# EAGLE design Adafruit NeoPixel Ring 60 Quarter rev B (EAGLE 9.6.2)
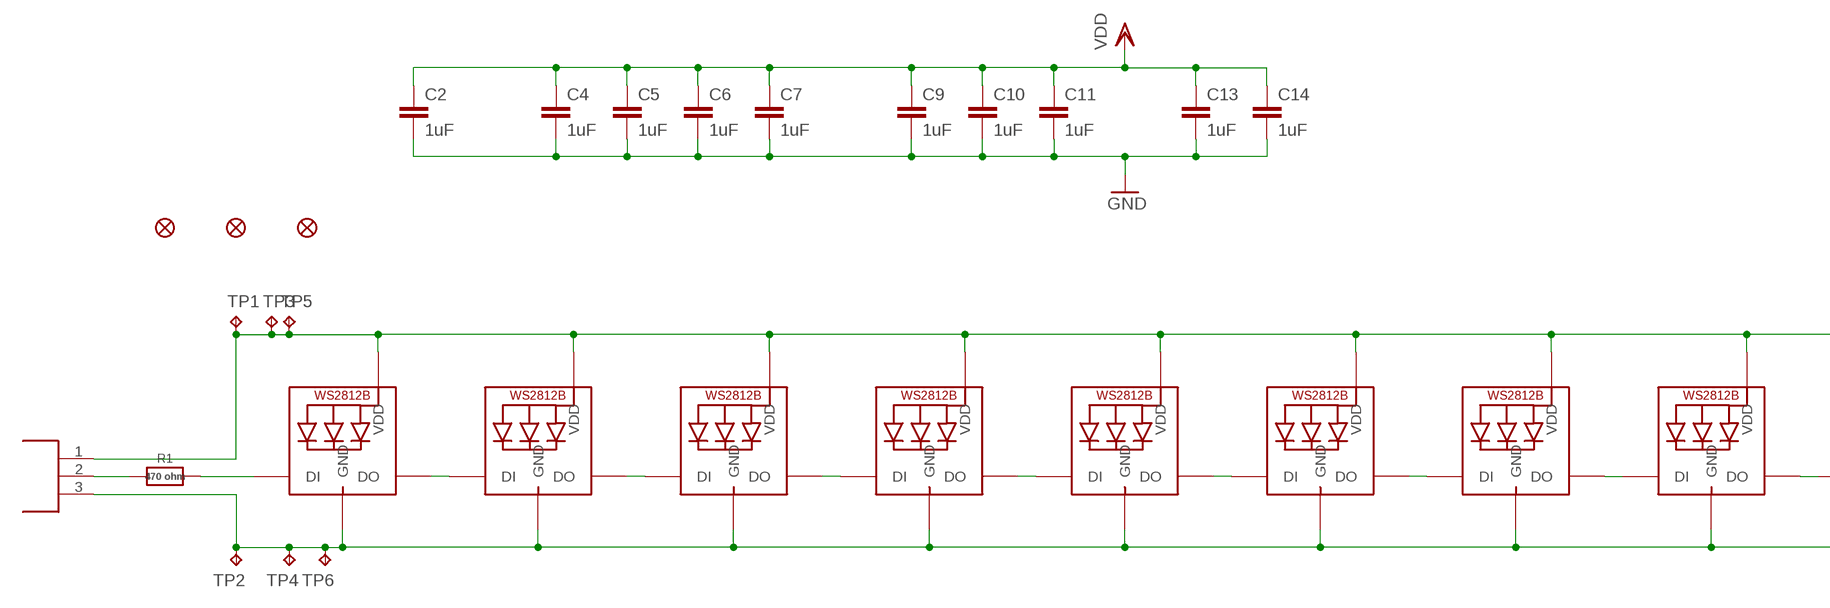
[diagram p0: schematic, sheet 1, part 1 of 2]
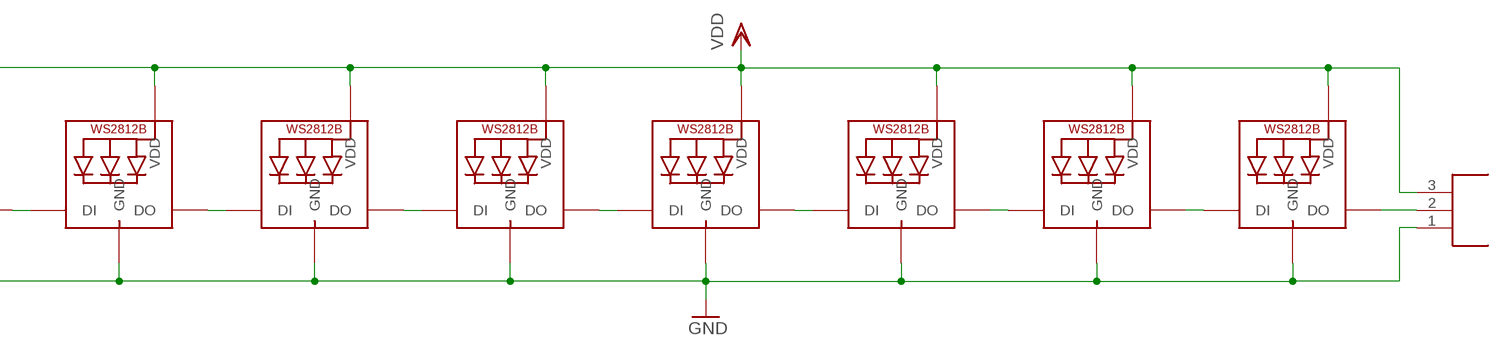
[diagram p1: schematic, sheet 1, part 2 of 2]

## Parts
C2  1uF  C-EUC0603  [C0603]
C4  1uF  C-EUC0603  [C0603]
C5  1uF  C-EUC0603  [C0603]
C6  1uF  C-EUC0603  [C0603]
C7  1uF  C-EUC0603  [C0603]
C9  1uF  C-EUC0603  [C0603]
C10  1uF  C-EUC0603  [C0603]
C11  1uF  C-EUC0603  [C0603]
C13  1uF  C-EUC0603  [C0603]
C14  1uF  C-EUC0603  [C0603]
FID1  FIDUCIAL_1MM  [FIDUCIAL_1MM]
FID2  FIDUCIAL_1MM  [FIDUCIAL_1MM]
FID3  FIDUCIAL_1MM  [FIDUCIAL_1MM]
LED1  WS2812B_5050N  [WS2812B-NARROW]
LED2  WS2812B_5050N  [WS2812B-NARROW]
LED3  WS2812B_5050N  [WS2812B-NARROW]
LED4  WS2812B_5050N  [WS2812B-NARROW]
LED5  WS2812B_5050N  [WS2812B-NARROW]
LED6  WS2812B_5050N  [WS2812B-NARROW]
LED7  WS2812B_5050N  [WS2812B-NARROW]
LED8  WS2812B_5050N  [WS2812B-NARROW]
LED9  WS2812B_5050N  [WS2812B-NARROW]
LED10  WS2812B_5050N  [WS2812B-NARROW]
LED11  WS2812B_5050N  [WS2812B-NARROW]
LED12  WS2812B_5050N  [WS2812B-NARROW]
LED13  WS2812B_5050N  [WS2812B-NARROW]
LED14  WS2812B_5050N  [WS2812B-NARROW]
LED15  WS2812B_5050N  [WS2812B-NARROW]
R1  470 ohm  RESISTOR_0603_NOOUT  [0603-NO]
TP1  TPTP20R  [TP20R]
TP2  TPTP20R  [TP20R]
TP3  TPTP20R  [TP20R]
TP4  TPTP20R  [TP20R]
TP5  TPTP20R  [TP20R]
TP6  TPTP20R  [TP20R]
U$1  DNP  RING_END_CONN_X3  [RING_END_CONN_X3]
U$2  DNP  RING_END_CONN_X3  [RING_END_CONN_X3]

## Nets
GND: C2.2 C4.2 C5.2 C6.2 C7.2 C9.2 C10.2 C11.2 C13.2 C14.2 LED1.3-GND(GND) LED2.3-GND(GND) LED3.3-GND(GND) LED4.3-GND(GND) LED5.3-GND(GND) LED6.3-GND(GND) LED7.3-GND(GND) LED8.3-GND(GND) LED9.3-GND(GND) LED10.3-GND(GND) LED11.3-GND(GND) LED12.3-GND(GND) LED13.3-GND(GND) LED14.3-GND(GND) LED15.3-GND(GND) TP2.TP TP4.TP TP6.TP U$1.3 U$2.1
N$1: LED1.2-DOUT(DO) LED2.4-DIN(DI)
N$2: LED2.2-DOUT(DO) LED3.4-DIN(DI)
N$3: LED3.2-DOUT(DO) LED4.4-DIN(DI)
N$4: LED4.2-DOUT(DO) LED5.4-DIN(DI)
N$5: LED5.2-DOUT(DO) LED6.4-DIN(DI)
N$6: LED6.2-DOUT(DO) LED7.4-DIN(DI)
N$7: LED7.2-DOUT(DO) LED8.4-DIN(DI)
N$8: LED8.2-DOUT(DO) LED9.4-DIN(DI)
N$9: LED9.2-DOUT(DO) LED10.4-DIN(DI)
N$10: LED10.2-DOUT(DO) LED11.4-DIN(DI)
N$11: LED11.2-DOUT(DO) LED12.4-DIN(DI)
N$12: LED12.2-DOUT(DO) LED13.4-DIN(DI)
N$13: LED13.2-DOUT(DO) LED14.4-DIN(DI)
N$14: LED14.2-DOUT(DO) LED15.4-DIN(DI)
N$15: LED1.4-DIN(DI) R1.2
N$16: LED15.2-DOUT(DO) U$2.2
N$17: R1.1 U$1.2
VDD: C2.1 C4.1 C5.1 C6.1 C7.1 C9.1 C10.1 C11.1 C13.1 C14.1 LED1.1-VDD(VDD) LED2.1-VDD(VDD) LED3.1-VDD(VDD) LED4.1-VDD(VDD) LED5.1-VDD(VDD) LED6.1-VDD(VDD) LED7.1-VDD(VDD) LED8.1-VDD(VDD) LED9.1-VDD(VDD) LED10.1-VDD(VDD) LED11.1-VDD(VDD) LED12.1-VDD(VDD) LED13.1-VDD(VDD) LED14.1-VDD(VDD) LED15.1-VDD(VDD) TP1.TP TP3.TP TP5.TP U$1.1 U$2.3

## Library data of the parts
C2 C4-C7 C9-C11 C13 C14 = rcl:C-EU: CAPACITOR, European symbol; SPICEPREFIX: C
FID1-FID3 = microbuilder:FIDUCIAL: Fiducial Alignment Points Various fiducial points for machine vision alignment.; BOM: EXCLUDE
LED1 = microbuilder:WS2812B
LED2-LED15 = microbuilder:WS2812B; ROT: 180
R1 = microbuilder:RESISTOR: Resistors For new designs, use the packages preceded by an '_' character since they are more reliable: The following footprints should be used on most boards: _0402 - Standard footprint for regular board layouts _0603 - Standard footprint for regular board layouts _0805 - Standard footprint for regular board layouts _1206 - Standard footprint for regular board layouts For extremely tight-pitch boards where space is at a premium, the following 'micro-pitch' footprints can be used (smaller pads, no silkscreen outline, etc.): _0402MP - Micro-pitch footprint for very dense/compact boards _0603MP - Micro-pitch footprint for very dense/compact boards _0805MP - Micro-pitch footprint for very dense/compact boards _1206MP - Micro-pitch footprint for very dense/compact boards
TP1-TP6 = testpad:TP: Test pad
U$1 U$2 = NeoPixelRing:RING_END_CONN_X3

## Board
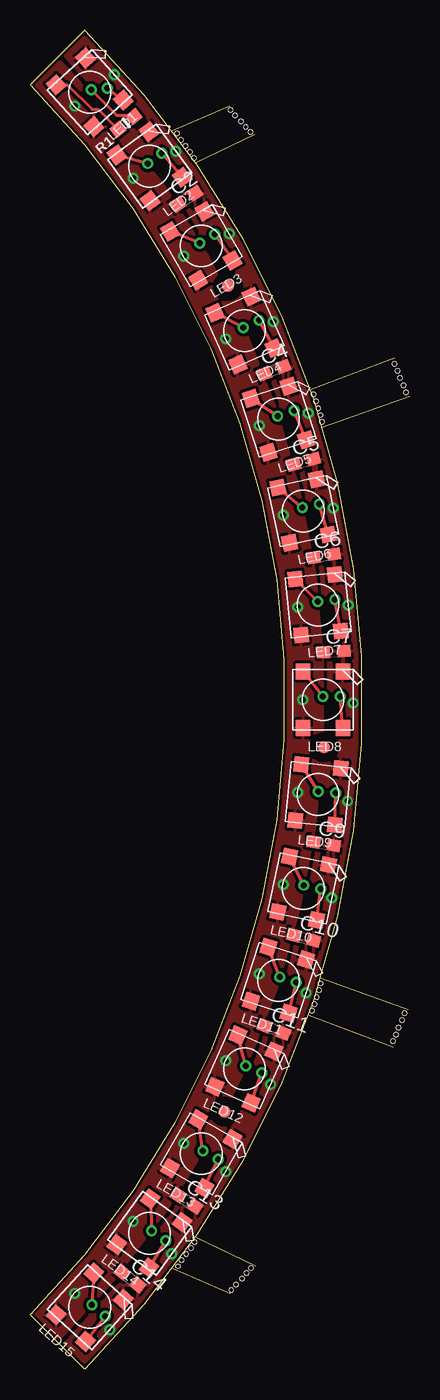
[diagram p2: board, top side]
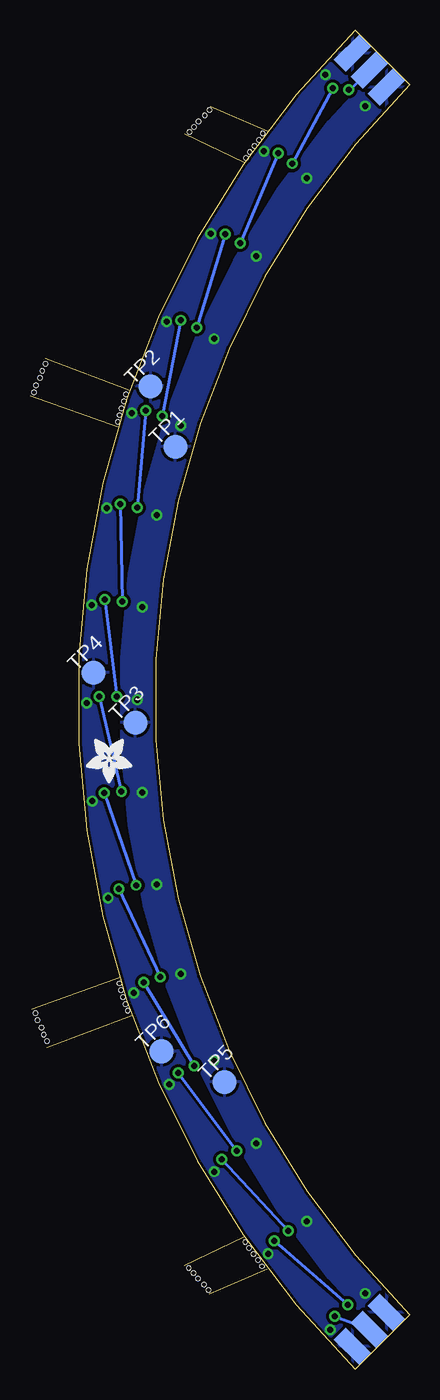
[diagram p3: board, bottom side, seen from below]

Size 31.6 x 111.51 mm. Coordinates in mm from the lower left corner, seen from the top.
Outline: 16.62,105.17 11.79,103.07
Outline: 13.76,100.47 18.71,102.82
Outline: 30.34,84.21 23.29,81.55
Outline: 24.3,78.44 31.61,81.04
Outline: 30.21,26.81 23.16,29.48
Outline: 24.18,32.59 31.48,29.99
Outline: 16.68,6.3 11.86,8.4
Outline: 13.83,11 18.78,8.65
Outline: 4.56,111.51 0,106.95 arc-90 0,4.56 4.56,0 arc90 4.56,111.51
Copper layers (1*16): Top 0.035mm / dielectric 1.5mm / Bottom 0.035mm
Design rules "adafruit_rules_1 *": minimum track width 8mil, minimum drill 15.5mil, track to track 8mil, track to pad 8mil, pad to pad 8mil, via to via 8mil, smd to smd 8mil, copper to edge 10mil, drill to drill 8mil, minimum pad ring 10mil, minimum via ring 8mil, stop-mask expansion 4mil, vias tented up to drill 25mil, thermal gap 10mil
Holes 0.35 mm at 12.24,102.88 12.55,102.38 12.94,101.87 13.32,101.36 13.63,100.85 16.68,104.85 17.06,104.41 17.57,103.9 17.95,103.46 18.33,103.01 23.6,81.17 23.79,80.6 23.98,80.02 24.18,79.45 24.3,78.88 30.33,83.71 30.59,83.14 30.78,82.56 31.1,81.93 31.29,81.36 23.48,29.86 23.67,30.43 23.86,31 24.05,31.57 24.18,32.14 30.21,27.32 30.46,27.89 30.65,28.46 30.97,29.1 31.16,29.67 12.3,8.59 12.62,9.09 13,9.6 13.38,10.11 13.7,10.62 16.75,6.62 17.13,7.06 17.63,7.57 18.02,8.01 18.4,8.46

### Footprints (pad centres in the part's own frame; a part is rotated, then mirrored left to right if it is on the bottom)
C0603 = smd 1.1 x 1: 1 -0.85,0; 2 0.85,0
FIDUCIAL_1MM = smd 1 x 1: 1 0,0
WS2812B-NARROW = smd 1.3 x 1.2: 1-VDD 2.35,-1.65; 2-DOUT 2.35,1.65; 3-GND -2.35,1.65; 4-DIN -2.35,-1.65
0603-NO = smd 1.075 x 1: 1 -0.85,0; 2 0.85,0
TP20R = smd 2 x 2: TP 0,0
RING_END_CONN_X3 = smd 3 x 1.4: 1 1.5,2; 2 1.5,0; 3 1.5,-2

### Placement (x,y rotation side)
C2  13.03,97.46 33 top
C4  20.29,83.2 21 top
C5  22.77,75.57 15 top
C6  24.44,67.73 9 top
C7  25.28,59.76 3 top
C9  24.44,43.78 351 top
C10  22.77,35.94 345 top
C11  20.29,28.31 339 top
C13  13.03,14.05 327 top
C14  8.32,7.57 321 top
FID1  16.48,90.19 315 top
FID2  24.47,51.8 315 top
FID3  16.19,21.46 315 top
LED1  4.97,106.32 312 top
LED2  9.95,100.18 306 top
LED3  14.26,93.54 300 top
LED4  17.85,86.49 294 top
LED5  20.68,79.11 288 top
LED6  22.73,71.47 282 top
LED7  23.97,63.66 276 top
LED8  24.38,55.76 270 top
LED9  23.97,47.86 264 top
LED10  22.73,40.04 258 top
LED11  20.68,32.4 252 top
LED12  17.85,25.02 246 top
LED13  14.26,17.97 240 top
LED14  9.95,11.33 234 top
LED15  4.97,5.19 228 top
PLABEL0  [PLABEL0]  8.5,105.03 45 bottom
PLABEL1  [PLABEL1]  6.5,103.99 45 bottom
PLABEL2  [PLABEL2]  4.31,103.39 45 bottom
PLABEL3  [PLABEL3]  3.2,6.91 135 bottom
PLABEL4  [PLABEL4]  4.26,5.37 135 bottom
PLABEL5  [PLABEL5]  6.11,4.02 135 bottom
PLABEL6  [PLABEL6]  17.65,87.35 60 bottom
PLABEL7  [PLABEL7]  15.31,87.07 60 bottom
PLABEL8  [PLABEL8]  20.15,82.55 45 bottom
PLABEL9  [PLABEL9]  24.75,58.58 45 bottom
PLABEL10  [PLABEL10]  21.28,27.97 45 bottom
PLABEL11  [PLABEL11]  20.29,73.5 45 bottom
PLABEL12  [PLABEL12]  22.49,50.38 45 bottom
PLABEL13  [PLABEL13]  14.14,20.82 45 bottom
R1  7.99,103.77 219 top
TP1  19.52,76.83 45 bottom
TP2  21.57,81.85 45 bottom
TP3  22.84,53.85 45 bottom
TP4  26.3,58.02 45 bottom
TP5  15.41,23.94 45 bottom
TP6  20.65,26.48 45 bottom
U$1  2.28,109.23 225 bottom
U$2  2.28,2.28 135 bottom
U$3  [ADAFRUIT_3.5MM]  25.03,48.26 45 bottom

### Tracks (layer width: path | path; a pad name or v marks a point on that pad's centre or on a via)
GND  (via drill 0.5)
  other vias: 7.02,107.78 12.14,101.41 16.56,94.54 20.25,87.25 23.15,79.61 25.23,71.71 26.48,63.63 26.88,55.47 26.42,47.31 25.11,39.24 22.97,31.36 20.01,23.74 16.28,16.47 11.8,9.63 6.63,3.3
  pour Top (isolate 0.254, rank 2): -0.28,106.67 4.67,111.62 arc-90 4.67,-0.11 -0.28,4.84 arc90
  pour Bottom (isolate 0.254): 2.55,109.5 arc-90 2.55,2.02 4.67,-0.11 arc90 4.67,111.62
N$1  (via drill 0.5)
  Top 0.254: v9.78,100.4 LED2.4-DIN | LED1.2-DOUT v6.42,106.66
  Bottom 0.254: v6.42,106.66 v9.78,100.4
N$2  (via drill 0.5)
  Top 0.254: v14.12,93.78 LED3.4-DIN | LED2.2-DOUT v10.95,101.26
  Bottom 0.254: v10.95,101.26 v14.12,93.78
N$3  (via drill 0.5)
  Top 0.254: v17.73,86.75 LED4.4-DIN | LED3.2-DOUT v15.37,94.51
  Bottom 0.254: v15.37,94.51 v17.73,86.75
N$4  (via drill 0.5)
  Top 0.254: v20.6,79.37 LED5.4-DIN | LED4.2-DOUT v19.06,87.34
  Bottom 0.254: v19.06,87.34 v20.6,79.37
N$5  (via drill 0.5)
  Top 0.254: v22.67,71.74 LED6.4-DIN | LED5.2-DOUT v21.97,79.83
  Bottom 0.254: v21.97,79.83 v22.67,71.74
N$6  (via drill 0.5)
  Top 0.254: v23.94,63.93 LED7.4-DIN | LED6.2-DOUT v24.09,72.05
  Bottom 0.254: v24.09,72.05 v23.94,63.93
N$7  (via drill 0.5)
  Top 0.254: v24.38,56.03 LED8.4-DIN | LED7.2-DOUT v25.38,64.09
  Bottom 0.254: v25.38,64.09 v24.38,56.03
N$8  (via drill 0.5)
  Top 0.254: v23.99,48.13 LED9.4-DIN | LED8.2-DOUT v25.83,56.04
  Bottom 0.254: v25.83,56.04 v23.99,48.13
N$9  (via drill 0.5)
  Top 0.254: v22.79,40.31 LED10.4-DIN | LED9.2-DOUT v25.44,47.99
  Bottom 0.254: v25.44,47.99 v22.79,40.31
N$10  (via drill 0.5)
  Top 0.254: v20.77,32.67 LED11.4-DIN | LED10.2-DOUT v24.21,40.02
  Bottom 0.254: v24.21,40.02 v20.77,32.67
N$11  (via drill 0.5)
  Top 0.254: v17.96,25.27 LED12.4-DIN | LED11.2-DOUT v22.15,32.22
  Bottom 0.254: v22.15,32.22 v17.96,25.27
N$12  (via drill 0.5)
  Top 0.254: v14.39,18.21 LED13.4-DIN | LED12.2-DOUT v19.29,24.68
  Bottom 0.254: v19.29,24.68 v14.39,18.21
N$13  (via drill 0.5)
  Top 0.254: LED14.4-DIN v10.11,11.56 | LED13.2-DOUT v15.65,17.49
  Bottom 0.254: v15.65,17.49 v10.11,11.56
N$14  (via drill 0.5)
  Top 0.254: LED15.4-DIN v5.15,5.39 | LED14.2-DOUT v11.29,10.71
  Bottom 0.254: v11.29,10.71 v5.15,5.39
N$15
  Top 0.254: LED1.4-DIN 3.09,106.97 5.16,104.9 5.66,104.9 R1.2
N$16  (via drill 0.5)
  Top 0.254: LED15.2-DOUT v6.24,4.43
  Bottom 0.254: v6.24,4.43 U$2.2
N$17  (via drill 0.5)
  Top 0.254: 8.81,104.3 R1.1 8.55,104.4 7.21,104.4 v5.09,106.53
  Bottom 0.254: U$1.2 4.56,106.95 4.95,106.53 v5.09,106.53
VDD  (via drill 0.5)
  other vias: 3.71,105.19 8.57,99.18 12.78,92.69 16.29,85.8 19.06,78.58 21.07,71.11 22.28,63.48 22.68,55.76 22.28,48.03 21.07,40.4 19.06,32.93 16.29,25.71 12.78,18.82 8.57,12.33 3.71,6.32
  pour Top (isolate 0.254): -0.28,106.67 2.26,109.21 arc-90 2.26,2.3 -0.28,4.84 arc90
  pour Bottom (isolate 0.254): -0.28,106.67 2.05,109 arc-90 2.05,2.51 -0.28,4.84 arc90

### Text on the board
Pinguin_bBackup: GND | DIN | 5V | Adafruit NeoPixel | Ring 60 Quarter | G | + | G | + | G | + | DOUT | GND | 5V